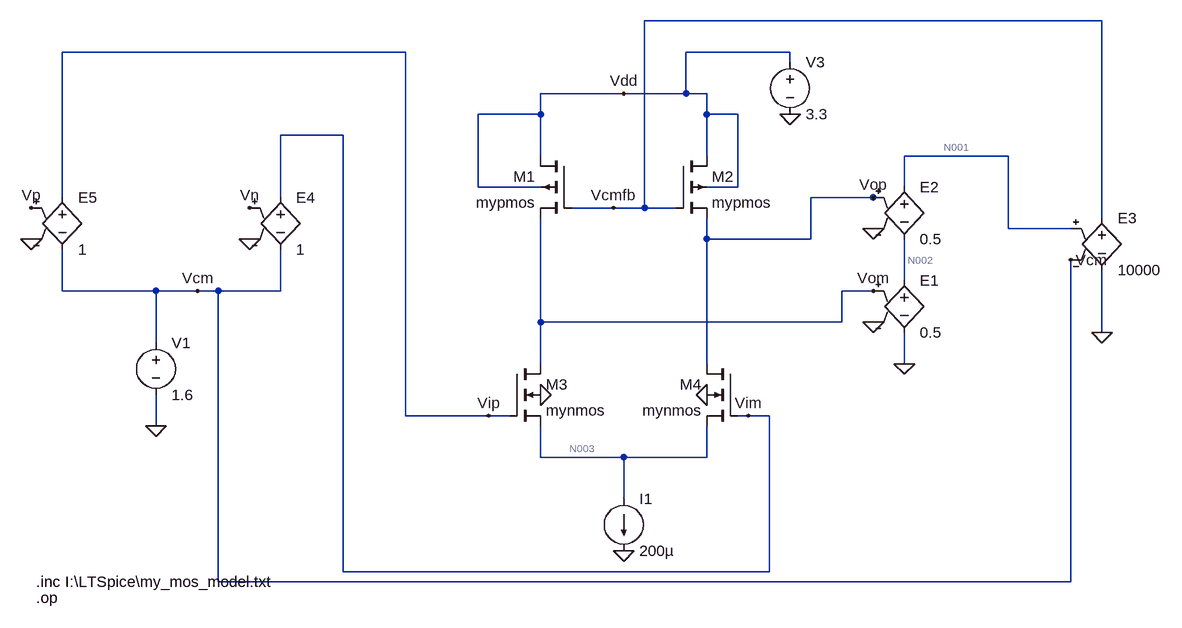
[diagram p0: schematic GmUsingTrans.asc]
GmUsingTrans.asc, the LTspice schematic file:
Version 4
SHEET 1 1412 680
WIRE 1008 -416 304 -416
WIRE -64 -368 -592 -368
WIRE 528 -368 368 -368
WIRE 528 -352 528 -368
WIRE 272 -304 144 -304
WIRE 368 -304 368 -368
WIRE 368 -304 272 -304
WIRE 400 -304 368 -304
WIRE 144 -272 144 -304
WIRE 144 -272 48 -272
WIRE 400 -272 400 -304
WIRE 448 -272 400 -272
WIRE -160 -240 -256 -240
WIRE 144 -208 144 -272
WIRE 400 -208 400 -272
WIRE 864 -208 704 -208
WIRE 48 -160 48 -272
WIRE 144 -160 48 -160
WIRE 448 -160 448 -272
WIRE 448 -160 400 -160
WIRE 704 -160 704 -208
WIRE -592 -144 -592 -368
WIRE -256 -144 -256 -240
WIRE 656 -144 560 -144
WIRE 672 -144 656 -144
WIRE 256 -128 192 -128
WIRE 304 -128 304 -416
WIRE 304 -128 256 -128
WIRE 352 -128 304 -128
WIRE 1008 -112 1008 -416
WIRE 864 -96 864 -208
WIRE 960 -96 864 -96
WIRE 400 -80 400 -112
WIRE 560 -80 560 -144
WIRE 560 -80 400 -80
WIRE 704 -16 704 -80
WIRE -592 0 -592 -64
WIRE -448 0 -592 0
WIRE -384 0 -448 0
WIRE -352 0 -384 0
WIRE -256 0 -256 -64
WIRE -256 0 -352 0
WIRE 656 0 608 0
WIRE 144 48 144 -112
WIRE 608 48 608 0
WIRE 608 48 144 48
WIRE 1008 64 1008 -32
WIRE -448 80 -448 0
WIRE 144 112 144 48
WIRE 400 112 400 -80
WIRE 704 112 704 64
WIRE -64 192 -64 -368
WIRE 64 192 -64 192
WIRE 96 192 64 192
WIRE 464 192 448 192
WIRE 496 192 464 192
WIRE -448 208 -448 160
WIRE 144 256 144 208
WIRE 272 256 144 256
WIRE 400 256 400 208
WIRE 400 256 272 256
WIRE 272 320 272 256
WIRE -160 432 -160 -240
WIRE 496 432 496 192
WIRE 496 432 -160 432
WIRE -352 448 -352 0
WIRE 960 448 960 -48
WIRE 960 448 -352 448
FLAG 272 -304 Vdd
FLAG 64 192 Vip
FLAG 464 192 Vim
FLAG 656 48 0
FLAG 656 -96 0
FLAG 656 -144 Vop
FLAG 656 0 Vom
FLAG 704 112 0
FLAG 1008 64 0
FLAG 256 -128 Vcmfb
FLAG -384 0 Vcm
FLAG -448 208 0
FLAG 528 -272 0
FLAG 144 160 0
FLAG 400 160 0
FLAG 960 -48 Vcm
FLAG 272 400 0
FLAG -640 -128 Vp
FLAG -304 -128 Vn
FLAG -304 -80 0
FLAG -640 -80 0
SYMBOL nmos4 96 112 R0
SYMATTR InstName M3
SYMATTR Value mynmos
SYMATTR Value2 l=0.5u w=4.05u m=4
SYMBOL nmos4 448 112 M0
SYMATTR InstName M4
SYMATTR Value mynmos
SYMATTR Value2 l=0.5u w=4.05u m=4
SYMBOL pmos4 192 -208 M0
SYMATTR InstName M1
SYMATTR Value mypmos
SYMATTR Value2 l=0.5u w=4.05u m=14
SYMBOL pmos4 352 -208 R0
SYMATTR InstName M2
SYMATTR Value mypmos
SYMATTR Value2 l=0.5u w=4.05u m=14
SYMBOL e 704 -32 R0
SYMATTR InstName E1
SYMATTR Value 0.5
SYMBOL e 704 -176 R0
SYMATTR InstName E2
SYMATTR Value 0.5
SYMBOL voltage -448 64 R0
WINDOW 123 0 0 Left 2
WINDOW 39 0 0 Left 2
SYMATTR InstName V1
SYMATTR Value 1.6
SYMBOL e -256 -160 R0
SYMATTR InstName E4
SYMATTR Value 1
SYMBOL voltage 528 -368 R0
WINDOW 123 0 0 Left 2
WINDOW 39 0 0 Left 2
SYMATTR InstName V3
SYMATTR Value 3.3
SYMBOL current 272 320 R0
WINDOW 123 0 0 Left 2
WINDOW 39 0 0 Left 2
SYMATTR InstName I1
SYMATTR Value 200µ
SYMBOL e 1008 -128 R0
SYMATTR InstName E3
SYMATTR Value 10000
SYMBOL e -592 -160 R0
SYMATTR InstName E5
SYMATTR Value 1
TEXT -632 448 Left 2 !.inc I:\\LTSpice\\my_mos_model.txt
TEXT -632 472 Left 2 !.op

The netlist it stands for:
* GmUsingTrans.asc
M3 Vom Vip N003 0 mynmos l=0.5u w=4.05u m=4
M4 Vop Vim N003 0 mynmos l=0.5u w=4.05u m=4
M1 Vdd Vcmfb Vom Vdd mypmos l=0.5u w=4.05u m=14
M2 Vdd Vcmfb Vop Vdd mypmos l=0.5u w=4.05u m=14
E1 N002 0 Vom 0 0.5
E2 N001 N002 Vop 0 0.5
V1 Vcm 0 1.6
E4 Vim Vcm Vn 0 1
V3 Vdd 0 3.3
I1 N003 0 200µ
E3 Vcmfb 0 N001 Vcm 10000
E5 Vip Vcm Vp 0 1
.model NMOS NMOS
.model PMOS PMOS
.lib standard.mos
.inc I:\LTSpice\my_mos_model.txt
.op
.backanno
.end

* Results of the author's LTspice run, read from the files saved beside the schematic
* Operating Point:
*   V(vom) = 1.6 V
*   V(vip) = 1.6 V
*   V(n003) = 525.3 mV
*   V(vop) = 1.6 V
*   V(vim) = 1.6 V
*   V(vdd) = 3.3 V
*   V(vcmfb) = 2.344 V
*   V(n002) = 800.1 mV
*   V(n001) = 1.6 V
*   V(vcm) = 1.6 V
*   V(vn) = 0 V
*   V(vp) = 0 V
*   Id(M2) = 100 µA
*   Ig(M2) = 0 A
*   Ib(M2) = 23.94 pA
*   Is(M2) = -100 µA
*   Id(M1) = 100 µA
*   Ig(M1) = 0 A
*   Ib(M1) = 23.94 pA
*   Is(M1) = -100 µA
*   Id(M4) = 100 µA
*   Ig(M4) = 0 A
*   Ib(M4) = -8.582 pA
*   Is(M4) = -100 µA
*   Id(M3) = 100 µA
*   Ig(M3) = 0 A
*   Ib(M3) = -8.582 pA
*   Is(M3) = -100 µA
*   I(I1) = 200 µA
*   I(E5) = 0 A
*   I(E3) = 0 A
*   I(E4) = 0 A
*   I(E2) = 0 A
*   I(E1) = 0 A
*   I(V3) = -200 µA
*   I(V1) = 0 A
* From the log:
*   Semiconductor Device Operating Points:
*                           --- BSIM3 MOSFETS ---
*   Name:        m2          m1          m4          m3
*   Model:     mypmos      mypmos      mynmos      mynmos
*   Id:        1.00e-04    1.00e-04    1.00e-04    1.00e-04
*   Vgs:       7.44e-01    7.44e-01    1.07e+00    1.07e+00
*   Vds:       1.70e+00    1.70e+00    1.07e+00    1.07e+00
*   Vbs:       1.70e+00    1.70e+00   -5.25e-01   -5.25e-01
*   Vth:      -7.94e-01   -7.94e-01    8.74e-01    8.74e-01
*   Vdsat:    -1.69e-01   -1.69e-01    1.68e-01    1.68e-01
*   Gm:        9.62e-04    9.62e-04    1.00e-03    1.00e-03
*   Gds:       1.61e-05    1.61e-05    1.47e-05    1.47e-05
*   Gmb        1.94e-04    1.94e-04    2.17e-04    2.17e-04
*   Cbd:       0.00e+00    0.00e+00    0.00e+00    0.00e+00
*   Cbs:       0.00e+00    0.00e+00    0.00e+00    0.00e+00
*   Cgsov:     1.12e-14    1.12e-14    4.20e-15    4.20e-15
*   Cgdov:     1.12e-14    1.12e-14    4.20e-15    4.20e-15
*   Cgbov:     7.00e-16    7.00e-16    1.81e-16    1.81e-16
*   dQgdVgb:   1.16e-13    1.16e-13    3.25e-14    3.25e-14
*   dQgdVdb:  -1.03e-14   -1.03e-14   -4.05e-15   -4.05e-15
*   dQgdVsb:  -9.77e-14   -9.77e-14   -2.62e-14   -2.62e-14
*   dQddVgb:  -4.92e-14   -4.92e-14   -1.40e-14   -1.40e-14
*   dQddVdb:   1.07e-14    1.07e-14    4.12e-15    4.12e-15
*   dQddVsb:   4.66e-14    4.66e-14    1.23e-14    1.23e-14
*   dQbdVgb:  -1.71e-14   -1.71e-14   -4.42e-15   -4.42e-15
*   dQbdVdb:   7.71e-17    7.71e-17    1.65e-17    1.65e-17
*   dQbdVsb:  -6.79e-15   -6.79e-15   -2.53e-15   -2.53e-15